# EasyEDA schematic SCH_CameraTrap_2022-12-09.json
TITLE: CameraTrap; REV: 1.0; Date: 2022-08-03; Sheet: 1/1; Drawn By: Grim-Squeaker; Company: L Design
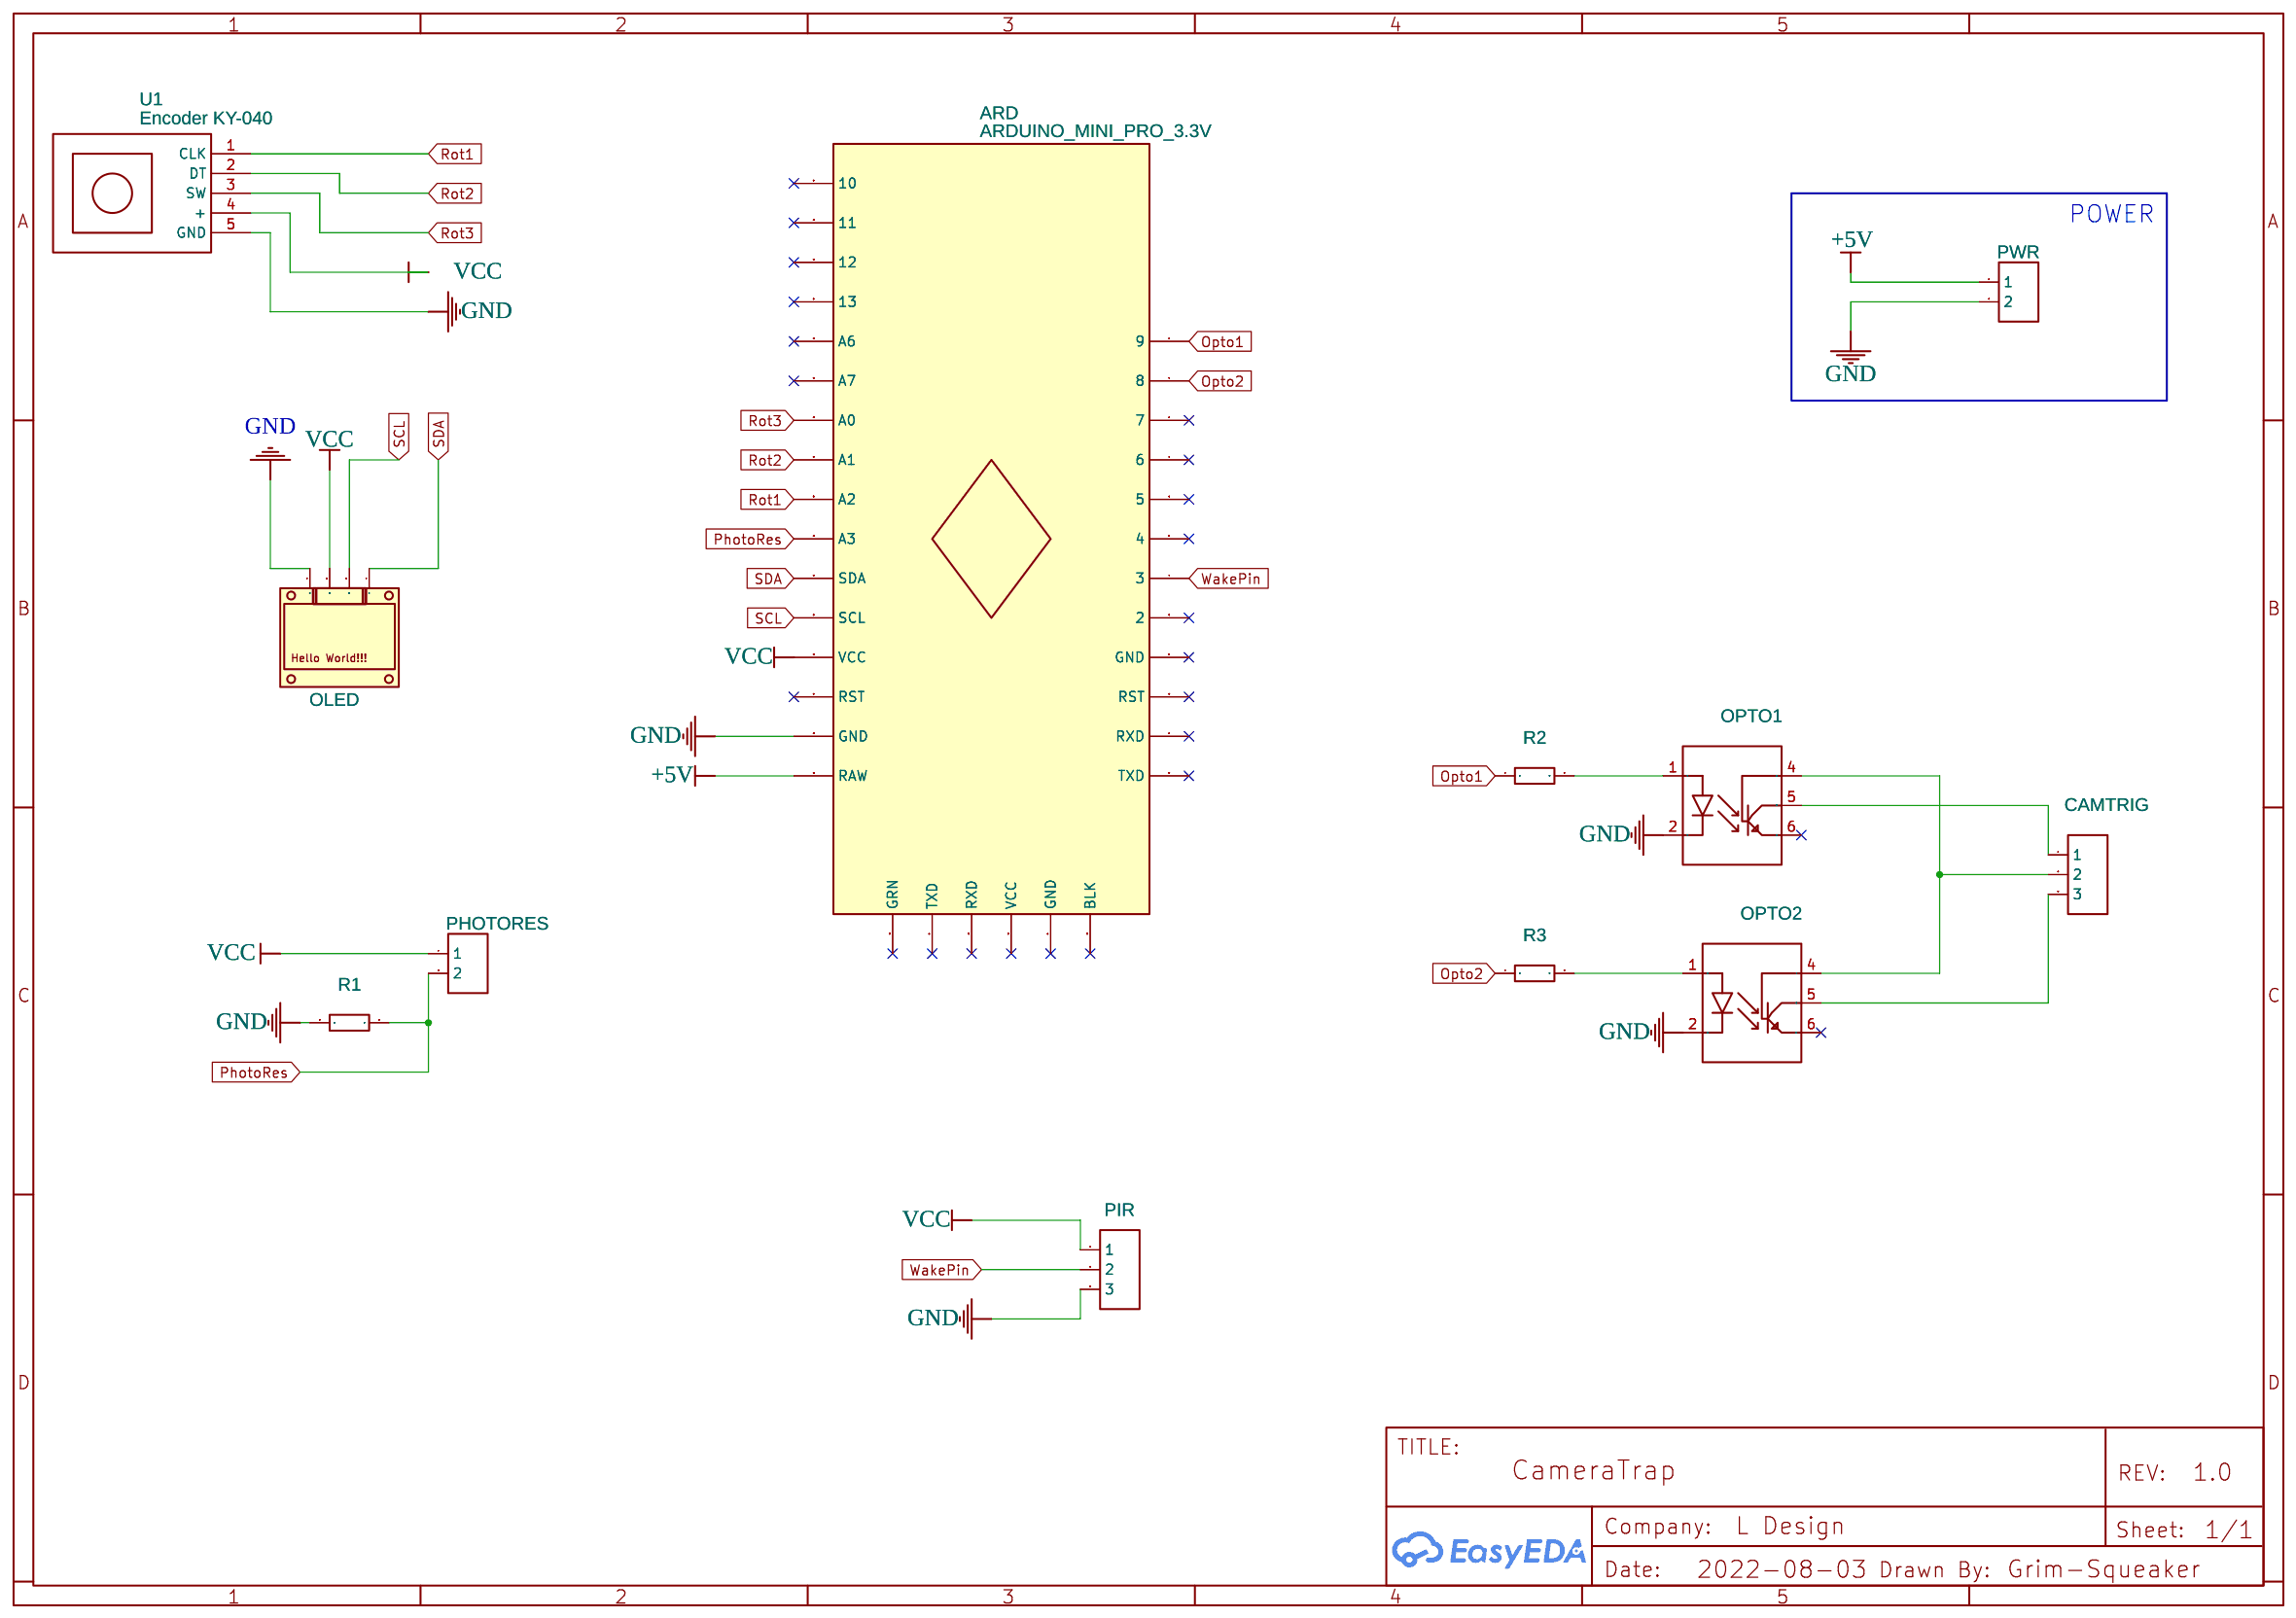
[diagram p0: schematic sheet]

## Parts
ARD  ARDUINO_MINI_PRO_3.3V  [ARDUINO PRO MINI 3.3V]
CAMTRIG  HDR-F-2.54_1x3  [HDR-F-2.54_1X3]
OLED1  OLED  [0.96OLED_4P]
OPTO1  CNY-17  [DIP6]
OPTO2  CNY-17  [DIP6]
PHOTORES  HDR-F-2.54_1x2  [HDR-F-2.54_1X2]
PIR  HDR-F-2.54_1x3  [HDR-F-2.54_1X3]
PWR  HDR-F-2.54_1x2  [HDR-F-2.54_1X2]
R1  10K  [GENERIC THROUGH-HOLE RESISTOR]
R2  10K  [GENERIC THROUGH-HOLE RESISTOR]
R3  10K  [GENERIC THROUGH-HOLE RESISTOR]
U1  Encoder KY-040  [KY-040]

## Library data of the parts
ARD = ARDUINO_MINI_PRO_3.3V: Manufacturer Part: Spurkfun; Contributor: felixzhdanov
CAMTRIG PIR = HDR-F-2.54_1x3: Supplier Part: C146690; Supplier: LCSC; Contributor: LCEDA_Lib
OLED1 = 0.96OLED_4P: Supplier: LCSC; Contributor: LCEDA_Lib
OPTO1 OPTO2 = CNY-17: Contributor: KiCad
PHOTORES PWR = HDR-F-2.54_1x2: Supplier Part: C49661; Supplier: LCSC; Contributor: LCEDA_Lib
R1-R3 = Resistor TH: Supplier: LCSC; Supplier Part: C348946; Manufacturer: ResistorToday; Manufacturer Part: EWWR0006J10K0T9; Contributor: sanketwalopkar; JLCPCB Part Class: Extended Part; Resistance: 10kΩ
U1 = Encoder KY-040: Contributor: Gojik 11

## Nets
+5V: ARD.19(RAW) PWR.1
GND: ARD.20(GND) OLED1.1 OPTO1.2 OPTO2.2 PIR.3 PWR.2 R1.1 U1.5(GND)
VCC: ARD.22(VCC) OLED1.2 PHOTORES.1 PIR.1 U1.4(+)
Opto1: ARD.1(9) R2.1
Opto2: ARD.2(8) R3.1
PhotoRes: ARD.25(A3) PHOTORES.2 R1.2
Rot1: ARD.26(A2) U1.1(CLK)
Rot2: ARD.27(A1) U1.2(DT)
Rot3: ARD.28(A0) U1.3(SW)
SCL: ARD.23(SCL) OLED1.3
SDA: ARD.24(SDA) OLED1.4
WakePin: ARD.7(3) PIR.2
Net-(CAMTRIG-1): CAMTRIG.1 OPTO1.5
Net-(CAMTRIG-2): CAMTRIG.2 OPTO1.4 OPTO2.4
Net-(CAMTRIG-3): CAMTRIG.3 OPTO2.5
Net-(OPTO1-1): OPTO1.1 R2.2
Net-(OPTO2-1): OPTO2.1 R3.2

Not connected (* = marked no-connect by the designer): ARD 3(7)* 4(6)* 5* 6(4)* 8(2)* 9(GND)* 10(RST)* 11(RXD)* 12(TXD)* 13(BLK)* 14(GND)* 15(VCC)* 16(RXD)* 17(TXD)* 18(GRN)* 21(RST)* 29(A7)* 30(A6)* 31(13)* 32(12)* 33(11)* 34(10)*; OPTO1 6*; OPTO2 6*

## Notes on the sheet
- POWER
